# Altium schematic sheet BlockDiagram.SchDoc (part 1 of 3)
size 420 x 297 mm; SheetNumber: 2; SheetTotal: 23
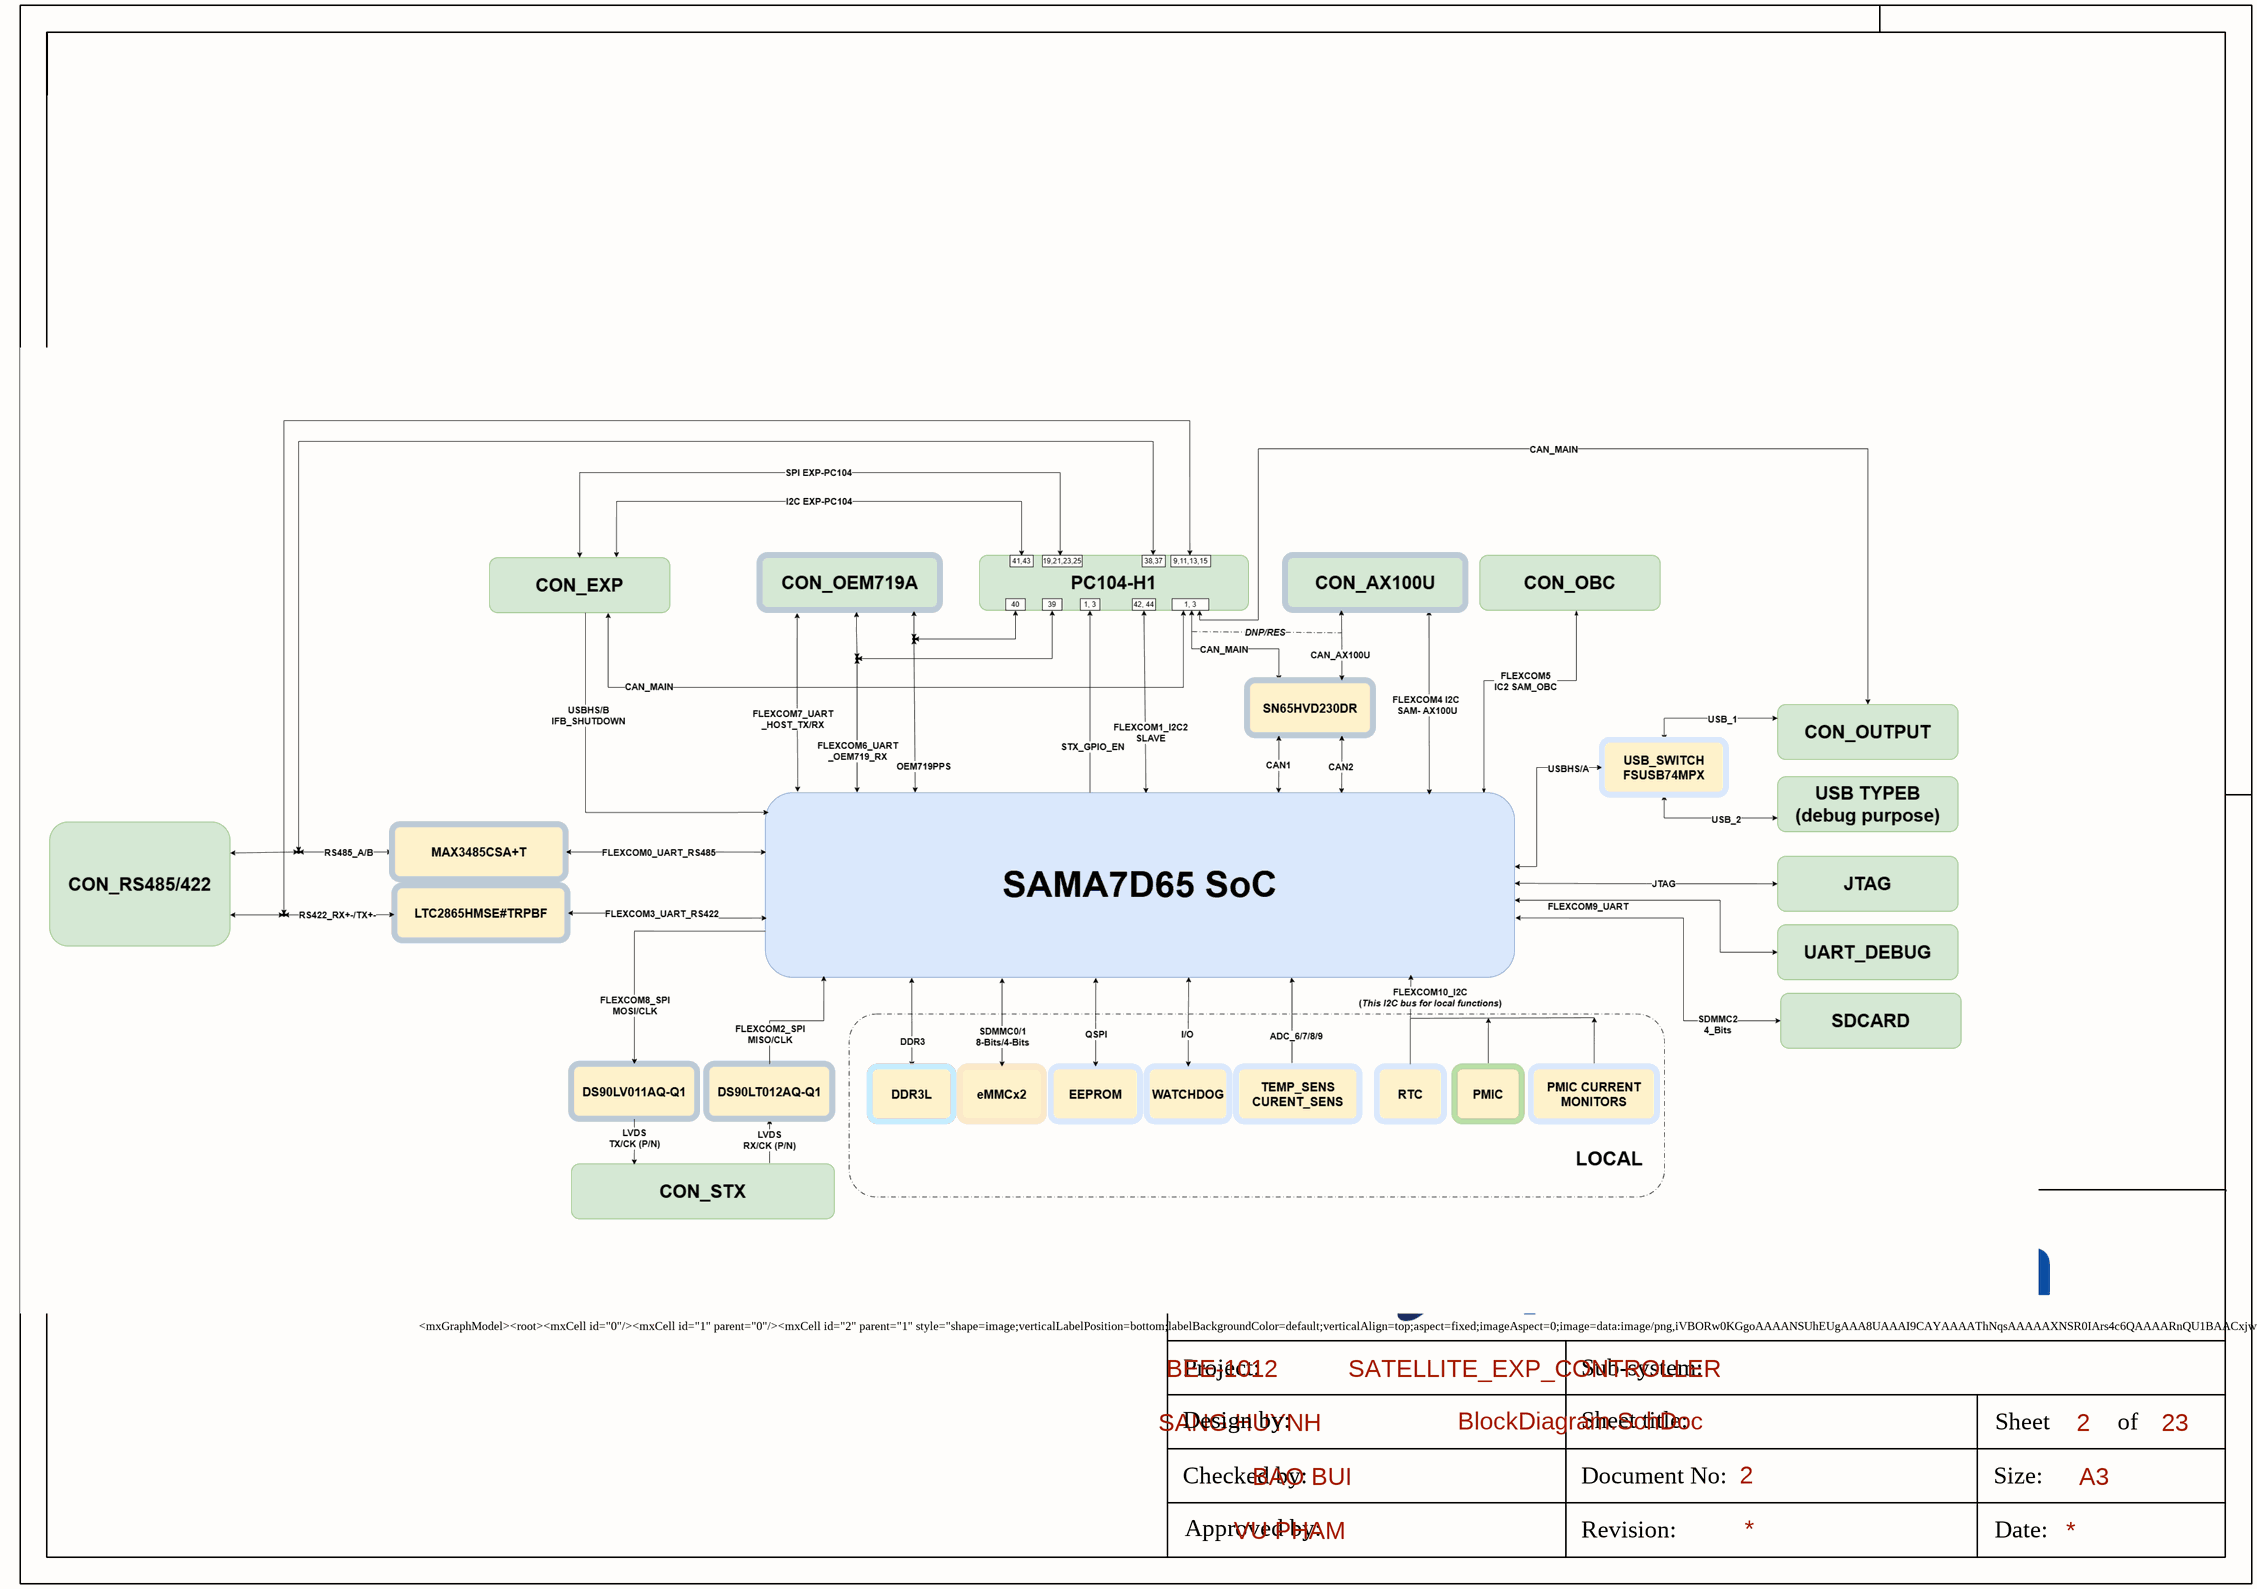
[diagram p0: BlockDiagram.SchDoc]
## Notes on the sheet